# Altium schematic sheet Laser_driver_adj_3A_TTL.SchDoc
size A4
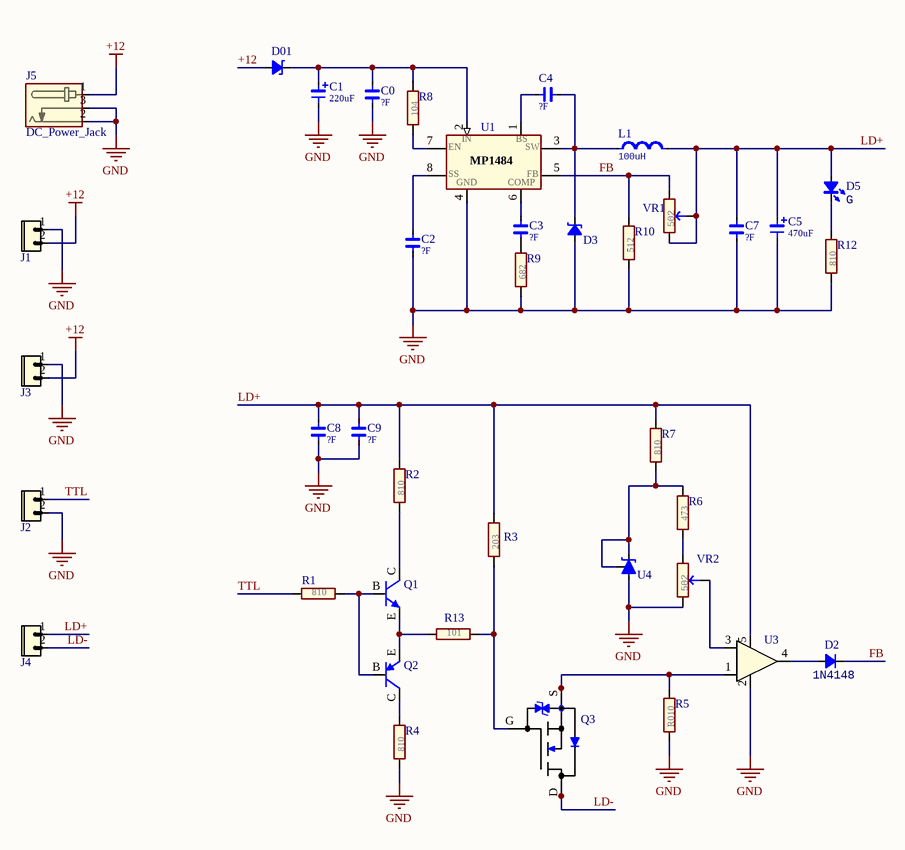
[diagram p0: Laser_driver_adj_3A_TTL.SchDoc]

## Parts
C0  value ?F  [CAP_0603]  (hidden comment: Cap)
C1  value 220uF  [CAP_PR_SMD_6.3]  (hidden comment: Cap_P)
C2  value ?F  [CAP_0603]  (hidden comment: Cap)
C3  value ?F  [CAP_0603]  (hidden comment: Cap)
C4  value ?F  [CAP_0603]  (hidden comment: Cap)
C5  value 470uF  [CAP_PR_SMD_8.3]  (hidden comment: Cap_P)
C7  value ?F  [CAP_0603]  (hidden comment: Cap)
C8  value ?F  [CAP_0603]  (hidden comment: Cap)
C9  value ?F  [CAP_0603]  (hidden comment: Cap)
D01  (no value)  [DO-214AC]
D2  1N4148  [SOD-80/MLL34]
D3  (no value)  [DO-214AC]
D5  G  [LED_0603]
J1  CON_XH2.54_2  [XH2.54_2]  (value not drawn)
J2  CON_XH2.54_2  [XH2.54_2]  (value not drawn)
J3  CON_XH2.54_2  [XH2.54_2]  (value not drawn)
J4  CON_XH2.54_2  [XH2.54_2]  (value not drawn)
J5  DC_Power_Jack  [DC005]
L1  value 100uH  [IND_SLF10145]  (hidden comment: Ind)
Q1  NPN  [SOT23-3M]  (value not drawn)
Q2  PNP  [SOT23-3M]  (value not drawn)
Q3  RSS100N003  [SOP8_M]  (value not drawn)
R1  value 810  [RES_0603]  (hidden comment: Res)
R2  value 810  [RES_0603]  (hidden comment: Res)
R3  value 203  [RES_0603]  (hidden comment: Res)
R4  value 810  [RES_0603]  (hidden comment: Res)
R5  value R010  [RES_2512M]  (hidden comment: Res)
R6  value 473  [RES_0603]  (hidden comment: Res)
R7  value 810  [RES_0603]  (hidden comment: Res)
R8  value 104  [RES_0603]  (hidden comment: Res)
R9  value 682  [RES_0603]  (hidden comment: Res)
R10  value 512  [RES_0603]  (hidden comment: Res)
R12  value 810  [RES_0603]  (hidden comment: Res)
R13  value 101  [RES_0603]  (hidden comment: Res)
U1  MP1484  [SOIC8N]  (value not drawn)
U3  LMV321  [SOT23-5AM]  (value not drawn)
U4  TL432  [SOT23-3M]  (value not drawn)
VR1  value 502  [RES_VR_EVM3G/E]  (hidden comment: VR)
VR2  value 502  [RES_VR_3296W]  (hidden comment: VR)

## Nets
+12: D01.1(A) J1.2 J3.2 J5.1
GND: C0.2 C1.2 C2.2 C5.2 C7.1 C8.1 C9.1 D3.1(A) J1.1 J2.2 J3.1 J5.2 J5.3 R4.1 R5.1 R9.1 R10.1 R12.2 U1.4(GND) U3.2(V-) U4.A(ANODE) VR2.3
FB: D2.2(K) R10.2 U1.5(FB) VR1.1
LD+: C5.1 C7.2 C8.2 C9.2 D5.1(A) J4.1 L1.2 R2.2 R3.2 R7.1 U3.5(V+) VR1.2 VR1.3
LD-: J4.2 Q3.D Q3.DD Q3.DDD Q3.DDDD
TTL: J2.1 R1.2
NetC0_1: C0.1 C1.1 D01.2(K) R8.2 U1.2(IN)
NetC2_1: C2.1 U1.8(SS)
NetC3_1: C3.1 U1.6(IN)
NetC3_2: C3.2 R9.2
NetC4_1: C4.1 U1.1(BS)
NetC4_2: C4.2 D3.2(K) L1.1 U1.3(SW)
NetD2_1: D2.1(A) U3.4(OUTPUT)
NetD5_2: D5.2(K) R12.1
NetQ1_B: Q1.B Q2.B R1.1
NetQ1_C: Q1.C R2.1
NetQ1_E: Q1.E Q2.E R13.2
NetQ2_C: Q2.C R4.2
NetQ3_G: Q3.G R3.1 R13.1
NetQ3_S: Q3.S Q3.SS Q3.SSS R5.2 U3.1(+IN)
NetR6_1: R6.1 VR2.1
NetR6_2: R6.2 R7.2 U4.C(CATHODE) U4.R(REF)
NetR8_1: R8.1 U1.7(EN)
NetU3_3: U3.3(-IN) VR2.2

## Notes on the sheet
- (in symbol MP1484) COMP

## Library data of the parts
D01 D3 = SchottkyDiode: Schottky Diode
D2 = Diode: Type: SMA; Value: 1N4148
D5 = LED: Value: G
J5 = DC_Power_Jack: pin to pad: 1>3 3>1
L1 = Ind: Inductor; Specification: ±5% 100mA; Manufacturer: *
Q1 = NPN: NPN General Purpose Amplifier; pin to pad: B>1 C>3 E>2; Published: 8-Jun-2000; LatestRevisionDate: 15-Jan-2003; LatestRevisionNote: PCB Footprint 'BCY-W3/D4.7' replaced; DatasheetVersion: 1997; PackageVersion: Sep-1998; PackageReference: TO-92A; Publisher: Altium Limited; PackageDescription: TO, Flat Index; 3 In-Line, Axial Leads; Body Dia. 4.5mm; Leads 0.51 x 0.48 mm (max); ComponentLink1Description: Manufacturer Link; ComponentLink1URL: http://www.fairchildsemi.com/; ComponentLink2Description: Datasheet; ComponentLink2URL: http://www.fairchildsemi.com/ds/2N%2F2N3904.pdf
Q2 = PNP: PNP General Purpose Amplifier; pin to pad: B>1 C>3 E>2; Published: 8-Jun-2000; LatestRevisionDate: 15-Jan-2003; LatestRevisionNote: PCB Footprint 'BCY-W3/D4.7' replaced; DatasheetVersion: 1997; PackageVersion: Sep-1998; PackageReference: TO-92A; Publisher: Altium Limited; PackageDescription: TO, Flat Index; 3 In-Line, Axial Leads; Body Dia. 4.5mm; Leads 0.51 x 0.48 mm (max); ComponentLink1Description: Manufacturer Link; ComponentLink1URL: http://www.fairchildsemi.com/; ComponentLink2Description: Datasheet; ComponentLink2URL: http://www.fairchildsemi.com/ds/2N%2F2N3906.pdf
Q3 = RSS100N003: pin to pad: D>6 DD>7 DDD>8 DDDD>5 G>4 S>3 SS>1 SSS>2
U1 = MP1484: • 3A Continuous Output Current / • Wide 4.75V to 18V Operating Input Range / • Integrated 85mΩ Power MOSFET Switches / • Output Adjustable from 0.925V to 20V / • Up to 95% Efficiency / • Programmable Soft-Start / • Stable with Low ESR Ceramic Output Capacitors / • Fixed 340KHz Frequency / • Cycle-by-Cycle Over Current Protection / • Input Under Voltage Lockout / • Thermally Enhanced 8-Pin SOIC Package
U4 = TL432: pin to pad: A>3 C>3 R>1
VR1 VR2 = Res_VR: Resistor Variable; Specification: ±5%; Manufacturer: *